# Altium schematic sheet Main.SchDoc
size 127 x 63 mm; PageSetup: Record=PageOptions|CenterHorizontal=True|CenterVertical=True|PrintScale=0.71|XCorrection=1.00|YCorrection=1.00|PrintKind=1|BorderSize=5000000|LeftOffset=0|BottomOffset=0|Orientation=2|PaperLength=1000|PaperWidth=1000|Scale=100|PaperSource=15|PrintQuality=4000|MediaType=1|DitherType=10|PrintScaleMode=1|PaperKind=A4|PaperIndex=9
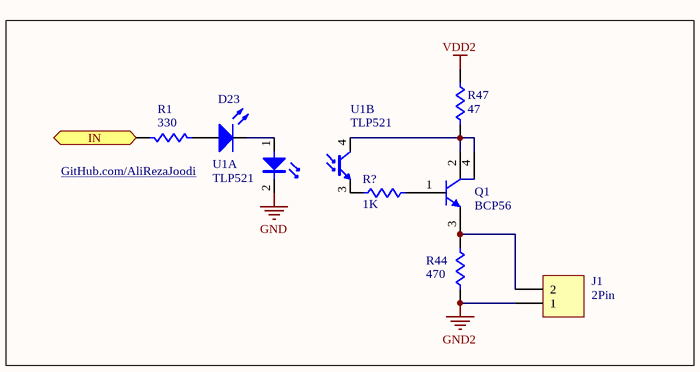
[diagram p0: Main.SchDoc]

## Parts
D23  YELLOW  [0805_Diode]  (value not drawn)
J1  2Pin  [Fonics_2PIN_1]
Q1  BCP56  [SOT223-4N]
R1  330  [0805]
R44  470  [RESC3216N]
R47  47  [RESC3216N]
R?  1K  [RESC3216N]
U1  TLP521  [SMD_4PIN]  (parts A,B of 2)

## Ports
IN (in)

## Nets
GND: U1.2(K)
GND2: J1.1 R44.2
VDD2: R47.1
IN: R1.1 ; port IN
NetD23_1: D23.1(A) R1.2
NetD23_2: D23.2(K) U1.1(A)
NetJ1_2: J1.2 Q1.3(E) R44.1
NetQ1_1: Q1.1(B) R?.2
NetQ1_2: Q1.2(C) Q1.4(C) R47.2 U1.4(C)
NetR?_1: R?.1 U1.3(E)

## Notes on the sheet
- GitHub.com/AliRezaJoodi

## Library data of the parts
D23 = LED: Typical INFRARED GaAs LED; Manufacturer: Generic Components; Class I: Optoelectronic; Published: 8-Jun-2000; Revision: July-2002: Re-released for DXP Platform.; Publisher: Altium Limited; Class II: LED
J1 = Header 2: Header, 2-Pin; LatestRevisionDate: 17-Jul-2002; LatestRevisionNote: Re-released for DXP Platform.; Publisher: Altium Limited
Q1 = BCP56: Silicon Bipolar Transistor; Package Reference: SOT−223
R1 R44 R47 R? = Res1: Resistor; Manufacturer: Generic Components; Class I: Passive; Published: 8-Jun-2000; Revision: July-2002: Re-released for DXP Platform.; Publisher: Altium Limited; Class II: Resistor
U1 = Optoisolator: Publisher: Altium Limited